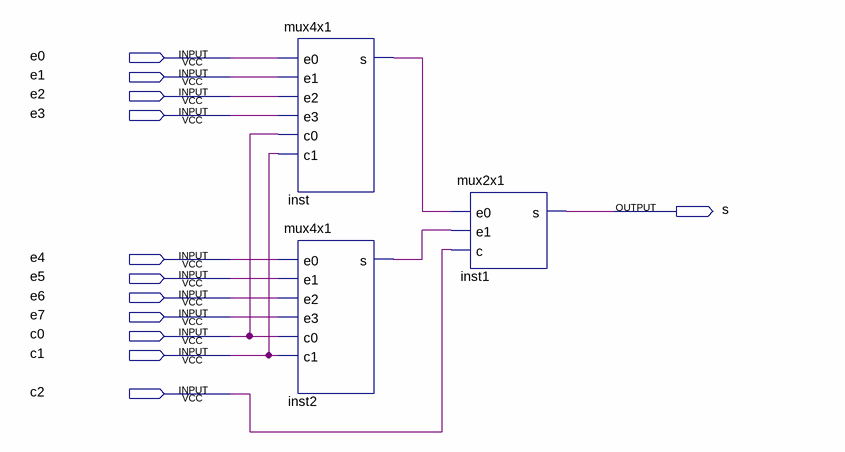
[diagram p0: schematic sheet]
// Quartus schematic mux8x1.bdf as structural Verilog: 3 symbols, 12 pins
module mux8x1 (
  input  e0,
  input  e1,
  input  e2,
  input  e3,
  input  e4,
  input  e5,
  input  e6,
  input  e7,
  input  c0,
  input  c1,
  input  c2,
  output s
);

  wire inst2_s, inst_s;

  mux4x1 inst (.e0(e0), .e1(e1), .e2(e2), .e3(e3), .c0(c0), .c1(c1), .s(inst_s));
  mux4x1 inst2 (.e0(e4), .e1(e5), .e2(e6), .e3(e7), .c0(c0), .c1(c1), .s(inst2_s));
  mux2x1 inst1 (.e0(inst_s), .e1(inst2_s), .c(c2), .s(s));
endmodule
